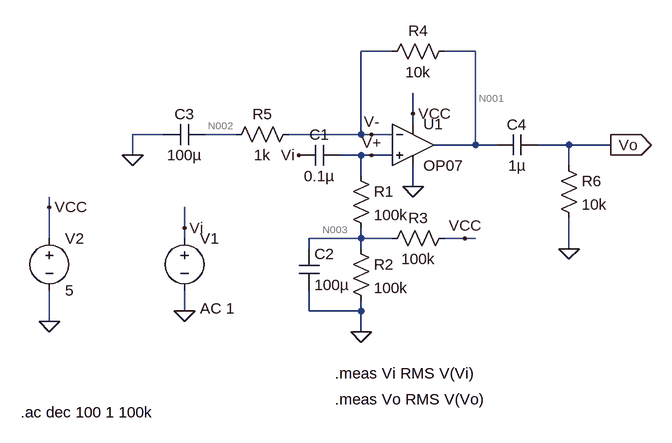
[diagram p0: schematic 1_6.asc]
1_6.asc, the LTspice schematic file:
Version 4
SHEET 1 880 680
WIRE 192 -16 144 -16
WIRE 320 -16 272 -16
WIRE 224 80 224 48
WIRE 224 96 224 80
WIRE -160 112 -208 112
WIRE -48 112 -96 112
WIRE 144 112 144 -16
WIRE 144 112 32 112
WIRE 160 112 144 112
WIRE 192 112 160 112
WIRE 320 128 320 -16
WIRE 320 128 256 128
WIRE 352 128 320 128
WIRE 464 128 416 128
WIRE 528 128 464 128
WIRE -208 144 -208 112
WIRE 144 144 112 144
WIRE 160 144 144 144
WIRE 192 144 160 144
WIRE 464 160 464 128
WIRE 144 176 144 144
WIRE 224 192 224 160
WIRE -336 224 -336 208
WIRE -128 256 -128 224
WIRE -336 272 -336 224
WIRE -128 272 -128 256
WIRE 144 272 144 256
WIRE 144 272 64 272
WIRE 192 272 144 272
WIRE 304 272 272 272
WIRE 320 272 304 272
WIRE 64 288 64 272
WIRE 144 288 144 272
WIRE 464 288 464 240
WIRE -128 384 -128 352
WIRE 64 384 64 352
WIRE 144 384 144 368
WIRE 144 384 64 384
WIRE -336 400 -336 352
WIRE 144 416 144 384
FLAG 144 416 0
FLAG 224 192 0
FLAG 464 288 0
FLAG -208 144 0
FLAG 224 80 VCC
FLAG 304 272 VCC
FLAG 528 128 Vo
IOPIN 528 128 Out
FLAG -128 384 0
FLAG 48 144 Vi
FLAG -128 256 Vi
FLAG -336 400 0
FLAG -336 224 VCC
FLAG 160 144 V+
FLAG 160 112 V-
SYMBOL OpAmps\\OP07 224 64 R0
SYMATTR InstName U1
SYMBOL cap 112 128 R90
WINDOW 0 0 32 VBottom 2
WINDOW 3 32 32 VTop 2
SYMATTR InstName C1
SYMATTR Value 0.1µ
SYMBOL res 128 160 R0
SYMATTR InstName R1
SYMATTR Value 100k
SYMBOL res 128 272 R0
SYMATTR InstName R2
SYMATTR Value 100k
SYMBOL res 288 256 R90
WINDOW 0 0 56 VBottom 2
WINDOW 3 32 56 VTop 2
SYMATTR InstName R3
SYMATTR Value 100k
SYMBOL cap 48 288 R0
SYMATTR InstName C2
SYMATTR Value 100µ
SYMBOL res 288 -32 R90
WINDOW 0 0 56 VBottom 2
WINDOW 3 32 56 VTop 2
SYMATTR InstName R4
SYMATTR Value 10k
SYMBOL res 48 96 R90
WINDOW 0 0 56 VBottom 2
WINDOW 3 32 56 VTop 2
SYMATTR InstName R5
SYMATTR Value 1k
SYMBOL cap -96 96 R90
WINDOW 0 0 32 VBottom 2
WINDOW 3 32 32 VTop 2
SYMATTR InstName C3
SYMATTR Value 100µ
SYMBOL cap 416 112 R90
WINDOW 0 0 32 VBottom 2
WINDOW 3 32 32 VTop 2
SYMATTR InstName C4
SYMATTR Value 1µ
SYMBOL res 448 144 R0
SYMATTR InstName R6
SYMATTR Value 10k
SYMBOL voltage -128 256 R0
WINDOW 123 24 124 Left 2
WINDOW 39 0 0 Left 0
SYMATTR InstName V1
SYMATTR Value ""
SYMATTR Value2 AC 1
SYMBOL voltage -336 256 R0
WINDOW 123 0 0 Left 0
WINDOW 39 0 0 Left 0
SYMATTR InstName V2
SYMATTR Value 5
TEXT 104 480 Left 2 !.meas Vi RMS V(Vi)
TEXT 104 520 Left 2 !.meas Vo RMS V(Vo)
TEXT -380 540 Left 2 !.ac dec 100 1 100k

The netlist it stands for:
* 1_6.asc
XU1 V+ V- VCC 0 N001 LT1001  ; OP07, pins In+ In- V+ V- OUT
C1 V+ Vi 0.1µ
R1 V+ N003 100k
R2 N003 0 100k
R3 VCC N003 100k
C2 N003 0 100µ
R4 N001 V- 10k
R5 V- N002 1k
C3 N002 0 100µ
C4 Vo N001 1µ
R6 Vo 0 10k
V1 Vi 0 AC 1
V2 VCC 0 5
.meas Vi RMS V(Vi)
.meas Vo RMS V(Vo)
.ac dec 100 1 100k
.lib LTC.lib
.backanno
.end

* Results of the author's LTspice run, read from the files saved beside the schematic
* Operating Point, zero values left out:
*   V(v-) = 2.5 V
*   V(v+) = 2.5 V
*   V(vcc) = 5 V
*   V(n001) = 2.5 V
*   V(n003) = 2.5 V
*   V(n002) = 2.5 V
*   I(R3) = 25 µA
*   I(R2) = 25 µA
*   I(V2) = -2.275 mA
*   Ix(u1:3) = 2.25 mA
*   Ix(u1:4) = -2.25 mA
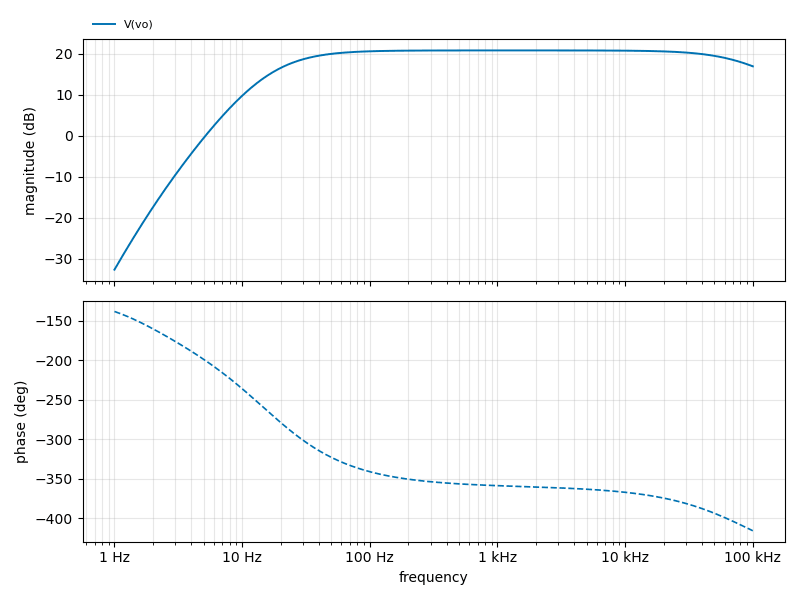
[diagram p1: AC Analysis of 1_6.asc, plotted from the saved traces]
* AC Analysis, 1 run:
*   V(vo): -32.67 dB at 1 Hz, 16.94 dB at 100 kHz, peak 20.83 dB at 1.38 kHz, 3 dB below the peak at 24.82 Hz and 83.29 kHz
* From the log:
*   vi: RMS(v(vi))=1 FROM 1 TO 100000
*   vo: RMS(v(vo))=9.39526 FROM 1 TO 100000